# Altium schematic sheet 电源.SchDoc
size A4
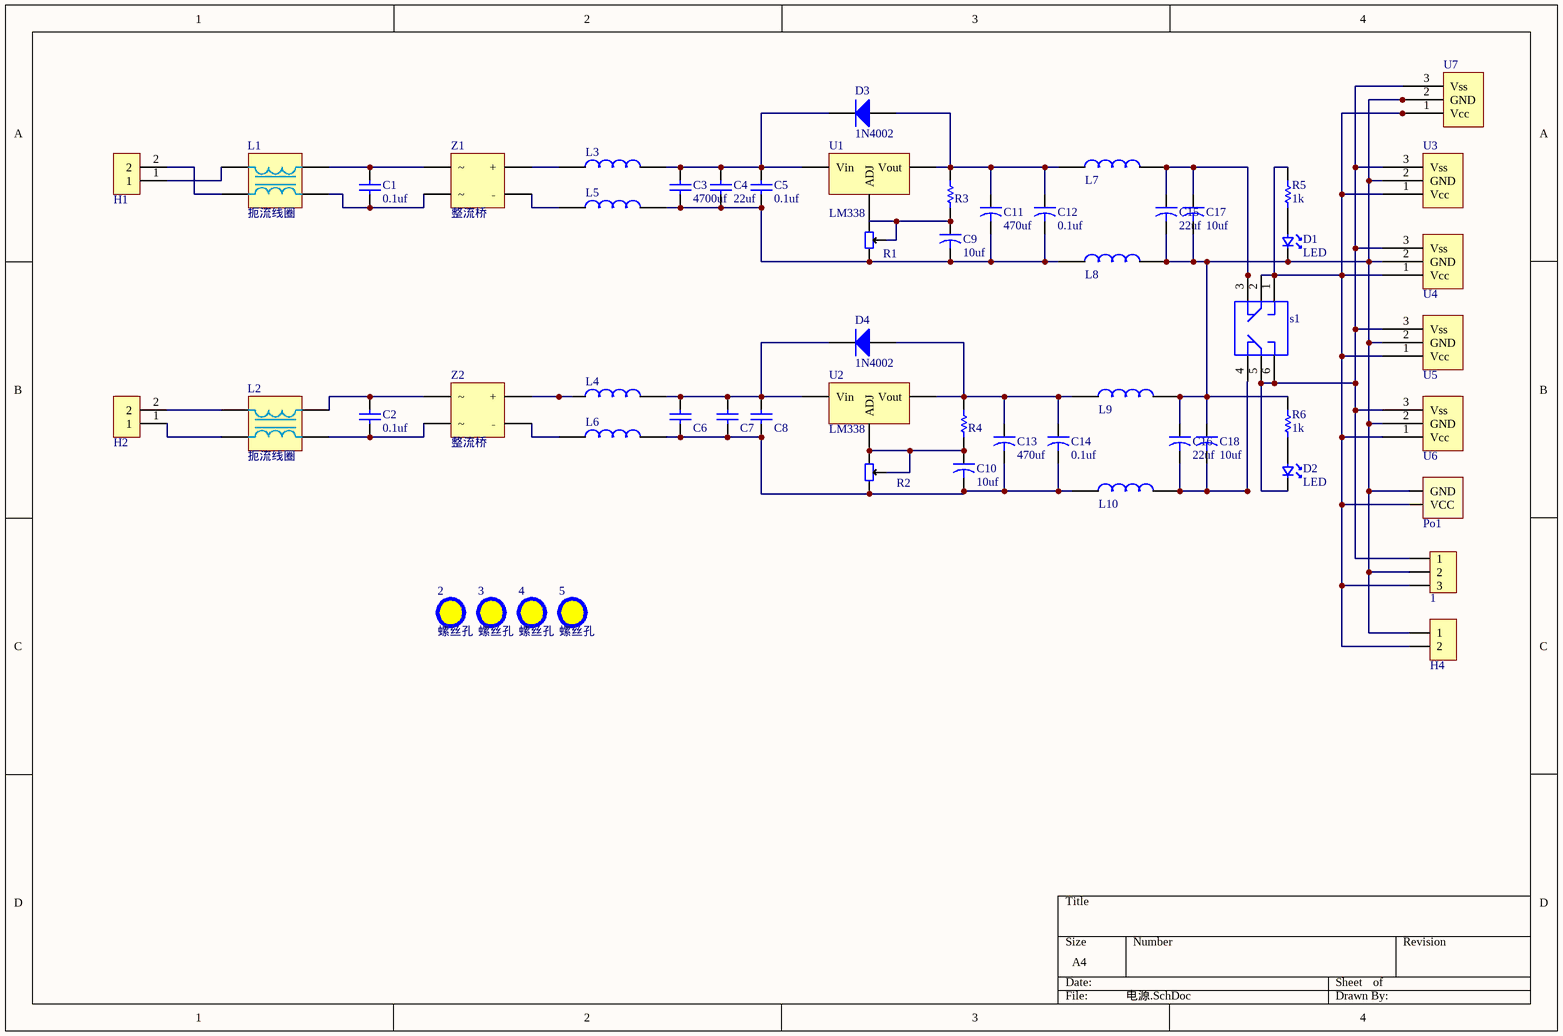
[diagram p0: 电源.SchDoc]

## Parts
1  KF128-5.08-3P  [KF128-5.08-3P]  (value not drawn)
2  螺丝孔  [固定过孔]
3  螺丝孔  [固定过孔]
4  螺丝孔  [固定过孔]
5  螺丝孔  [固定过孔]
C1  值: 0.1uf  [安规电容]
C2  值: 0.1uf  [安规电容]  (hidden comment: Cap1)
C3  值: 4700uf  [4700UF_50V]  (hidden comment: Cap1)
C4  值: 22uf  [22UF_50V]  (hidden comment: Cap1)
C5  值: 0.1uf  [独石电容]  (hidden comment: Cap1)
C6  Cap1  [4700UF_50V]  (value not drawn)
C7  Cap1  [22UF_50V]  (value not drawn)
C8  Cap1  [独石电容]  (value not drawn)
C9  值: 10uf  [陶瓷电容]  (hidden comment: Cap)
C10  值: 10uf  [陶瓷电容]  (hidden comment: Cap)
C11  值: 470uf  [C DIP DIA6.3]  (hidden comment: Cap)
C12  值: 0.1uf  [陶瓷电容]  (hidden comment: Cap)
C13  值: 470uf  [C DIP DIA6.3]  (hidden comment: Cap)
C14  值: 0.1uf  [陶瓷电容]  (hidden comment: Cap)
C15  值: 22uf  [22UF_50V]  (hidden comment: Cap)
C16  值: 22uf  [22UF_50V]  (hidden comment: Cap)
C17  值: 10uf  [陶瓷电容]  (hidden comment: Cap)
C18  值: 10uf  [陶瓷电容]  (hidden comment: Cap)
D1  LED  [0805_s]
D2  LED  [0805_s]
D3  1N4002  [SMC]
D4  1N4002  [SMC]
H1  HT3.96-2P  [HT39.6-2P-S]  (value not drawn)
H2  HT3.96-2P  [HT39.6-2P-S]  (value not drawn)
H4  KF128-5.08-2P  [KF128-5.08-2P]  (value not drawn)
L1  扼流线圈  [扼流线圈]
L2  扼流线圈  [扼流线圈]
L3  SMD  [功率电感-12x12 - duplicate]  (value not drawn)
L4  SMD  [功率电感-12x12 - duplicate]  (value not drawn)
L5  SMD  [功率电感-12x12 - duplicate]  (value not drawn)
L6  SMD  [功率电感-12x12 - duplicate]  (value not drawn)
L7  SMD  [功率电感-12x12 - duplicate]  (value not drawn)
L8  SMD  [功率电感-12x12 - duplicate]  (value not drawn)
L9  SMD  [功率电感-12x12 - duplicate]  (value not drawn)
L10  SMD  [功率电感-12x12 - duplicate]  (value not drawn)
Po1  Power_2Port  [Power_S_2Port]  (value not drawn)
R1  可调电位器1  [电位器]  (value not drawn)
R2  可调电位器1  [电位器]  (value not drawn)
R3  RES  [0805]  (value not drawn)
R4  RES  [0805]  (value not drawn)
R5  值: 1k  [0805]  (hidden comment: RES)
R6  值: 1k  [0805]  (hidden comment: RES)
s1  双掷开关  [SWITCH]  (value not drawn)
U1  LM338  [LM338]
U2  LM338  [LM338]
U3  XH2.54-3p  [XH2.54-3p]  (value not drawn)
U4  XH2.54-3p  [XH2.54-3p]  (value not drawn)
U5  XH2.54-3p  [XH2.54-3p]  (value not drawn)
U6  XH2.54-3p  [XH2.54-3p]  (value not drawn)
U7  XH2.54-3p  [XH2.54-3p]  (value not drawn)
Z1  整流桥  [整流桥]
Z2  整流桥  [整流桥]

## Nets
Net1_1: 1.1 D2.1 s1.5 s1.6 U3.3(Vss) U4.3(Vss) U5.3(Vss) U6.3(Vss) U7.3(Vss)
Net1_2: 1.2 C15.2 C16.1 C17.2 C18.1 D1.1 H4.1 L8.2 L9.2 Po1.2(GND) R6.2 U3.2(GND) U4.2(GND) U5.2(GND) U6.2(GND) U7.2(GND)
Net1_3: 1.3 H4.2 Po1.1(VCC) R5.2 s1.1 s1.2 U3.1(Vcc) U4.1(Vcc) U5.1(Vcc) U6.1(Vcc) U7.1(Vcc)
NetC1_1: C1.1 L1.3 Z1.3
NetC1_2: C1.2 L1.2 Z1.2
NetC2_1: C2.1 L2.3 Z2.3
NetC2_2: C2.2 L2.2 Z2.2
NetC3_1: C3.1 C4.1 C5.1 D3.2(K) L3.2 U1.1(Vin)
NetC3_2: C3.2 C4.2 C5.2 C9.2 C11.2 C12.2 L5.2 L8.1 R1.1
NetC6_1: C6.1 C7.1 C8.1 D4.2(K) L4.2 U2.1(Vin)
NetC6_2: C6.2 C7.2 C8.2 C10.2 C13.2 C14.2 L6.2 L10.1 R2.1
NetC9_1: C9.1 R1.2 R3.1 U1.2(ADJ)
NetC10_1: C10.1 R2.2 R2.3 R4.1 U2.2(ADJ)
NetC11_1: C11.1 C12.1 D3.1(A) L7.1 R3.2 U1.3(Vout)
NetC13_1: C13.1 C14.1 D4.1(A) L9.1 R4.2 U2.3(Vout)
NetC15_1: C15.1 C17.1 L7.2 s1.3
NetC16_2: C16.2 C18.2 L10.2 s1.4
NetD1_2: D1.2 R5.1
NetD2_2: D2.2 R6.1
NetH1_1: H1.1 L1.1
NetH1_2: H1.2 L1.4
NetH2_1: H2.1 L2.4
NetH2_2: H2.2 L2.1
NetL3_1: L3.1 Z1.1(+)
NetL4_1: L4.1 Z2.1(+)
NetL5_1: L5.1 Z1.4(﹣)
NetL6_1: L6.1 Z2.4(﹣)

Not connected (* = marked no-connect by the designer): R1 3

## Library data of the parts
C1 = Cap1
C6-C8 = Cap1: 值: 104
D3 D4 = Diode: Default Diode; Published: 8-Jun-2000; LatestRevisionDate: 17-Jul-2002; LatestRevisionNote: Re-released for DXP Platform.; PackageVersion: Sep-1996; PackageReference: SMC; Publisher: Altium Limited; PackageDescription: DO-214-AB/SMC; 2 C-Bend Leads; Body 7.9 x 5.9 mm, inc. leads (LxW); Code_JEDEC: DO-214-AB
L3-L10 = 功率电感
R3 R4 = RES: 值: 1k